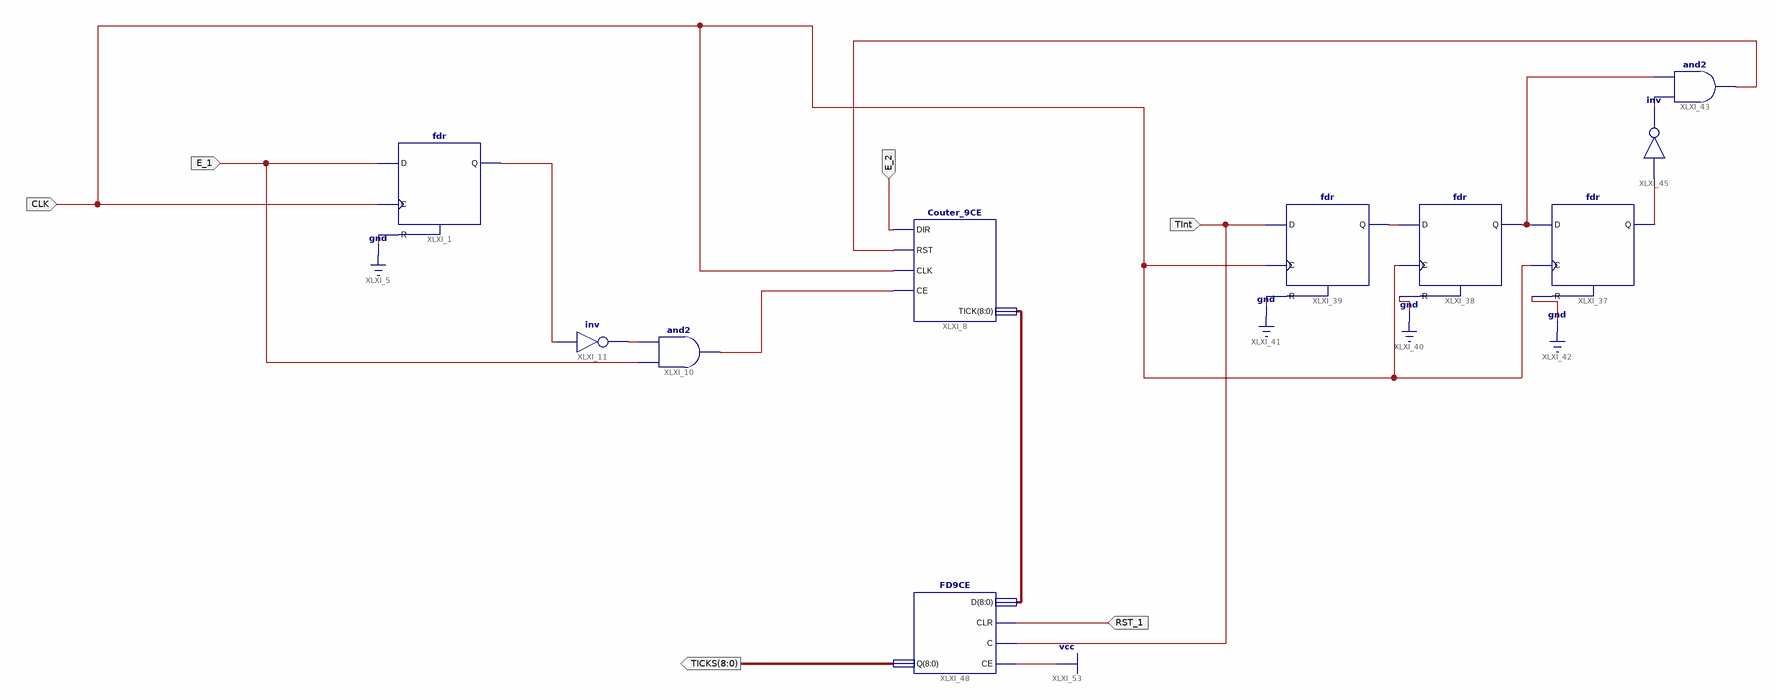
[diagram p0: schematic sheet 1]
// Xilinx ISE schematic ETC_SYNCRONOUS.sch (spartan3e) as structural Verilog: 10 symbols, 6 ports
module ETC_SYNCRONOUS (
  input  E_1,
  input  E_2,
  input  CLK,
  input  TInt,
  input  RST_1,
  output [8:0] TICKS
);

  wire XLXN_7, XLXN_26, XLXN_111, XLXN_118, XLXN_119, XLXN_122, XLXN_141, XLXN_150;
  wire [8:0] XLXN_146;

  Couter_9CE XLXI_8 (.DIR(E_2), .RST(XLXN_122), .CLK(CLK), .CE(XLXN_150), .TICK(XLXN_146));
  fdr XLXI_1 (.C(CLK), .D(E_1), .R(1'b0), .Q(XLXN_7));
  and XLXI_10 (XLXN_150, E_1, XLXN_26);
  not XLXI_11 (XLXN_26, XLXN_7);
  fdr XLXI_38 (.C(CLK), .D(XLXN_141), .R(1'b0), .Q(XLXN_111));
  fdr XLXI_39 (.C(CLK), .D(TInt), .R(1'b0), .Q(XLXN_141));
  not XLXI_45 (XLXN_119, XLXN_118);
  fdr XLXI_37 (.C(CLK), .D(XLXN_111), .R(1'b0), .Q(XLXN_118));
  and XLXI_43 (XLXN_122, XLXN_119, XLXN_111);
  FD9CE XLXI_48 (.CE(1'b1), .CLR(RST_1), .D(XLXN_146), .Q(TICKS), .C(TInt));
endmodule
